# EAGLE design weather (EAGLE 9.5.1)
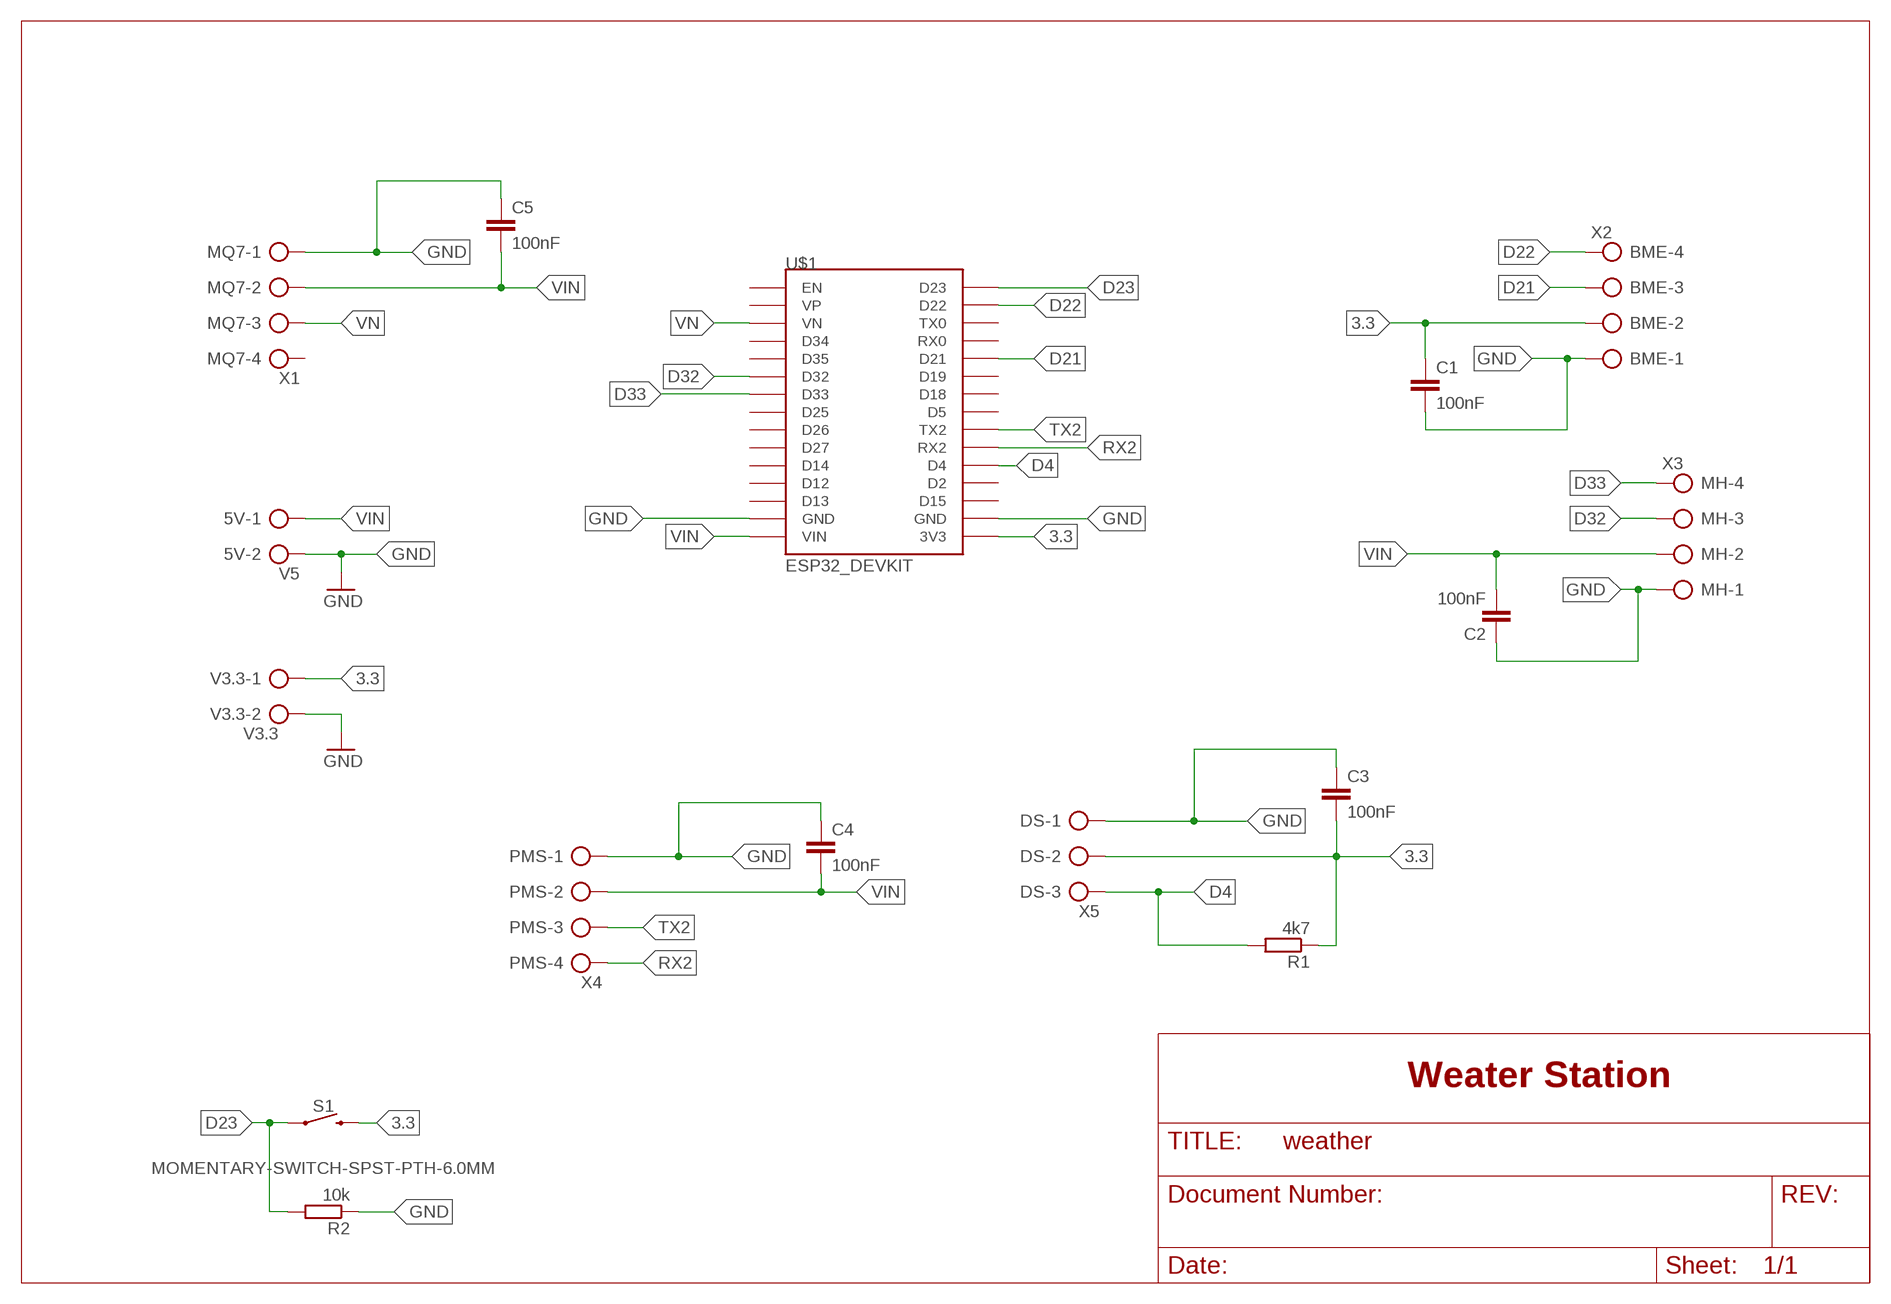
[diagram p0: schematic, sheet 1]

## Parts
5V  V5  AK500/2-H  [AK500/2-H]
BME  X2  AK500/4-H  [AK500/4-H]
C1  100nF  C-EU050-025X075  [C050-025X075]
C2  100nF  C-EU050-025X075  [C050-025X075]
C3  100nF  C-EU050-025X075  [C050-025X075]
C4  100nF  C-EU050-025X075  [C050-025X075]
C5  100nF  C-EU050-025X075  [C050-025X075]
DS  X5  AK500/3-H  [AK500/3-H]
MH  X3  AK500/4-H  [AK500/4-H]
MQ7  X1  AK500/4-H  [AK500/4-H]
PMS  X4  AK500/4-H  [AK500/4-H]
R1  4k7  R-EU_0207/10  [0207/10]
R2  10k  R-EU_0207/10  [0207/10]
S1  MOMENTARY-SWITCH-SPST-PTH-6.0MM  [TACTILE_SWITCH_PTH_6.0MM]
U$1  ESP32_DEVKIT  [ESP32_DEVKIT]
V3.3  V3.3  AK500/2-H  [AK500/2-H]

## Nets
3.3: BME.2 C1.1 C3.2 DS.2 R1.1 S1.3 U$1.3V3 V3.3.1
D4: DS.3 R1.2 U$1.D4
D21: BME.3 U$1.D21
D22: BME.4 U$1.D22
D23: R2.2 S1.1 U$1.D23
D32: MH.3 U$1.D32
D33: MH.4 U$1.D33
GND: 5V.2 BME.1 C1.2 C2.1 C3.1 C4.1 C5.1 DS.1 MH.1 MQ7.1 PMS.1 R2.1 U$1.GND@1(GND) U$1.GND@2(GND) V3.3.2
RX2: PMS.4 U$1.RX2
TX2: PMS.3 U$1.TX2
VIN: 5V.1 C2.2 C4.2 C5.2 MH.2 MQ7.2 PMS.2 U$1.VIN
VN: MQ7.3 U$1.VN
Unconnected: MQ7.4 U$1.D2 U$1.D5 U$1.D12 U$1.D13 U$1.D14 U$1.D15 U$1.D18 U$1.D19 U$1.D25 U$1.D26 U$1.D27 U$1.D34 U$1.D35 U$1.EN U$1.RX0 U$1.TX0 U$1.VP

## Notes on the sheet
- Weater Station

## Library data of the parts
5V V3.3 = con-ptr500:AK500/2-H: CONNECTOR Aug. 2004 / PTR Meßtechnik: Die Bezeichnung der Serie AK505 wurde geändert. Es handelt sich hierbei um AK500 in horizontaler Ausführung.; OC_FARNELL: unknown; OC_NEWARK: unknown
BME MH MQ7 PMS = con-ptr500:AK500/4-H: CONNECTOR Aug. 2004 / PTR Meßtechnik: Die Bezeichnung der Serie AK505 wurde geändert. Es handelt sich hierbei um AK500 in horizontaler Ausführung.; OC_FARNELL: unknown; OC_NEWARK: unknown
C1-C5 = rcl:C-EU: CAPACITOR, European symbol; SPICEPREFIX: C
DS = con-ptr500:AK500/3-H: CONNECTOR Aug. 2004 / PTR Meßtechnik: Die Bezeichnung der Serie AK505 wurde geändert. Es handelt sich hierbei um AK500 in horizontaler Ausführung.; OC_FARNELL: unknown; OC_NEWARK: unknown
R1 R2 = rcl:R-EU_: RESISTOR, European symbol; SPICEPREFIX: R
S1 = SparkFun-Switches:MOMENTARY-SWITCH-SPST: Momentary Switch (Pushbutton) - SPST Normally-open (NO) SPST momentary switches (buttons, pushbuttons). Variants PTH-12MM - 12mm square, through-hole Momentary Pushbutton Switch - 12mm Square <https://www.sparkfun.com/products/9190> (COM-09190) PTH-6.0MM, PTH-6.0MM-KIT - 6.0mm square, through-hole Mini Pushbutton Switch <https://www.sparkfun.com/products/97> (COM-00097) KIT package intended for soldering kit's - only one side of pads' copper is exposed. PTH-RIGHT-ANGLE-KIT - Right-angle, through-hole Right Angle Tactile Button <https://www.sparkfun.com/products/10791> - Used on SparkFun BigTime Watch Kit <https://www.sparkfun.com/products/11734> SMD-12MM - 12mm square, surface-mount Tactile Button - SMD (12mm) <https://www.sparkfun.com/products/12993> (COM-12993) Used on SparkFun PicoBoard <https://www.sparkfun.com/products/11888> SMD-4.5MM - 4.5mm Square Trackball Switch Used on SparkFun Blackberry Trackballer Breakout <https://www.sparkfun.com/products/13169> SMD-4.6MMX2.8MM - 4.60mm x 2.80mm, surface mount Used on SparkFun SAMD21 Mini Breakout <https://www.sparkfun.com/products/13664> SMD-5.2MM, SMD-5.2-REDUNDANT - 5.2mm square, surface-mount Mini Pushbutton Switch - SMD <https://www.sparkfun.com/products/8720> (COM-08720) Used on Arduino Pro Mini <https://www.sparkfun.com/products/11114> REDUNDANT package connects both switch circuits together SMD-6.0X3.5MM - 6.0 x 3.5mm, surface mount Momentary Reset Switch SMD <https://www.sparkfun.com/products/8229> (COM-08229) SMD-6.2MM-TALL - 6.2mm square, surface mount Tactile Button - SMD (6mm) <https://www.sparkfun.com/products/12992> Used on SparkFun Digital Sandbox <https://www.sparkfun.com/products/12651> SMD-RIGHT-ANGLE - Right-angle, surface mount Used on SparkFun Block for Intel® Edison - Arduino <https://www.sparkfun.com/products/13036>; PROD_ID: SWCH-08441; SF_SKU: COM-00097
U$1 = DOIT_ESP32_DEVKIT:ESP32_DEVKIT: ESP32 DEVKIT BOARD

## Board
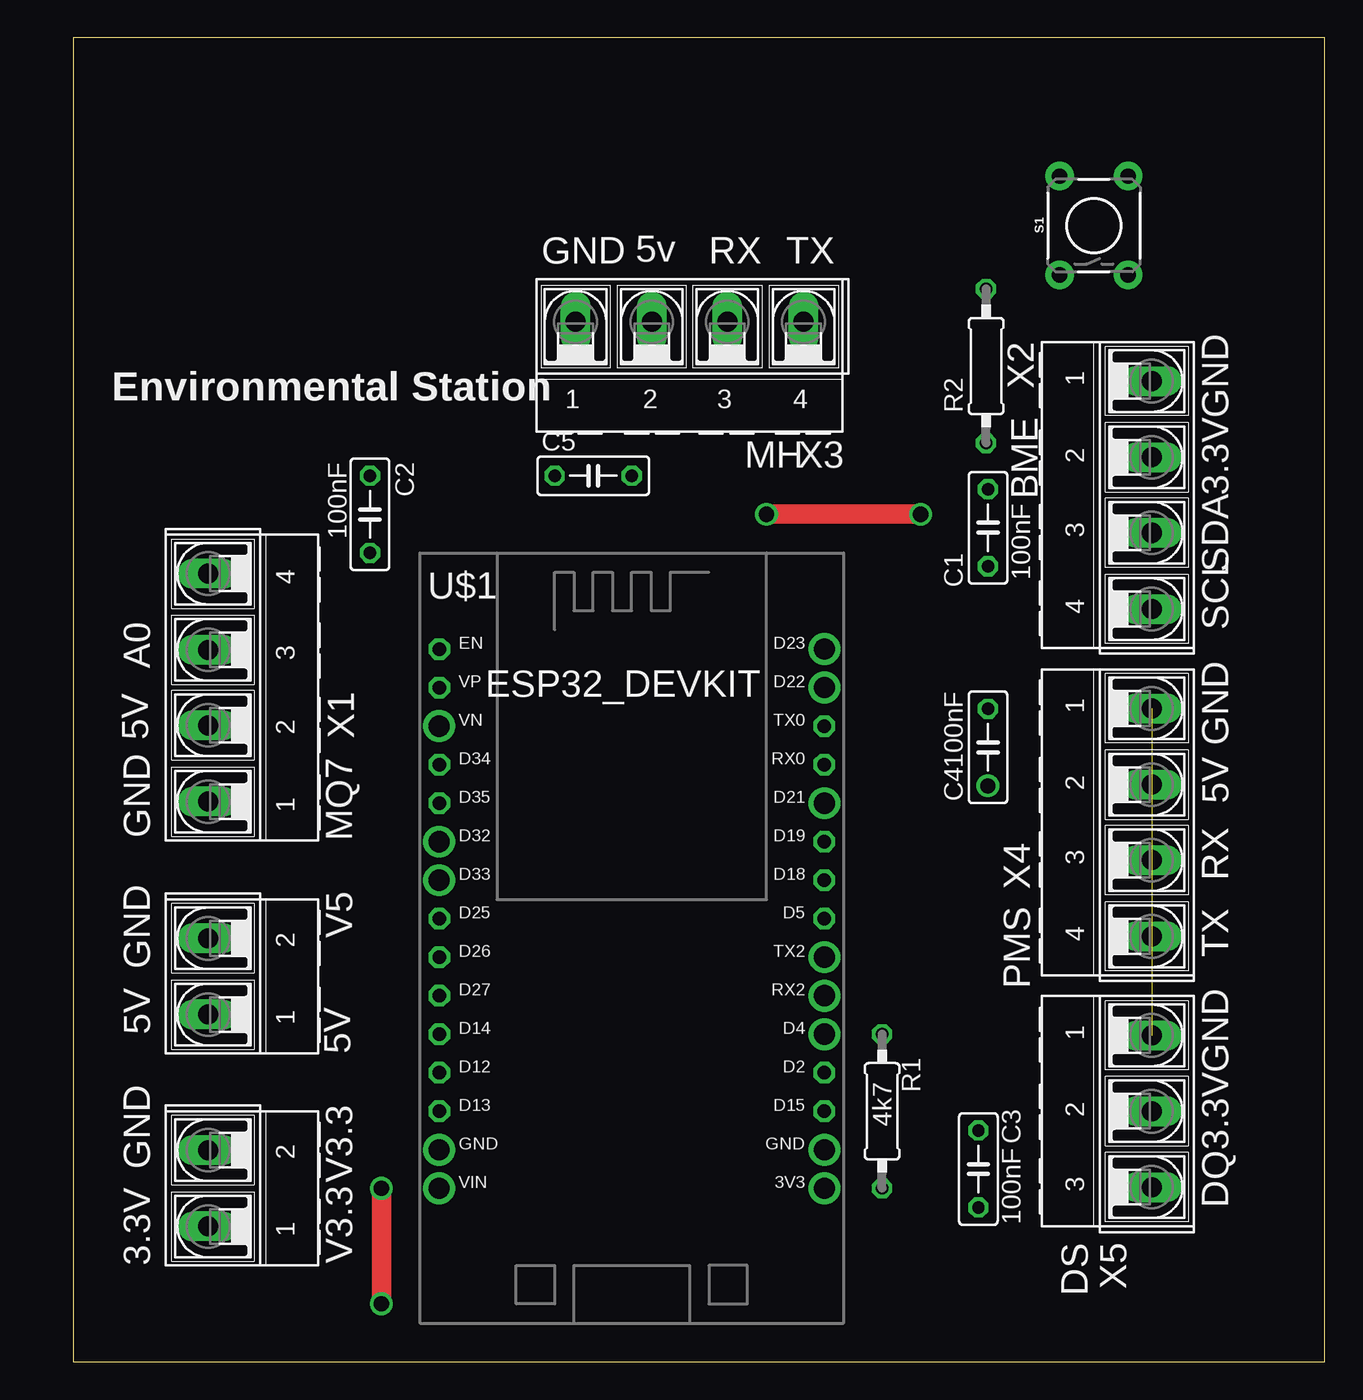
[diagram p1: board, top side]
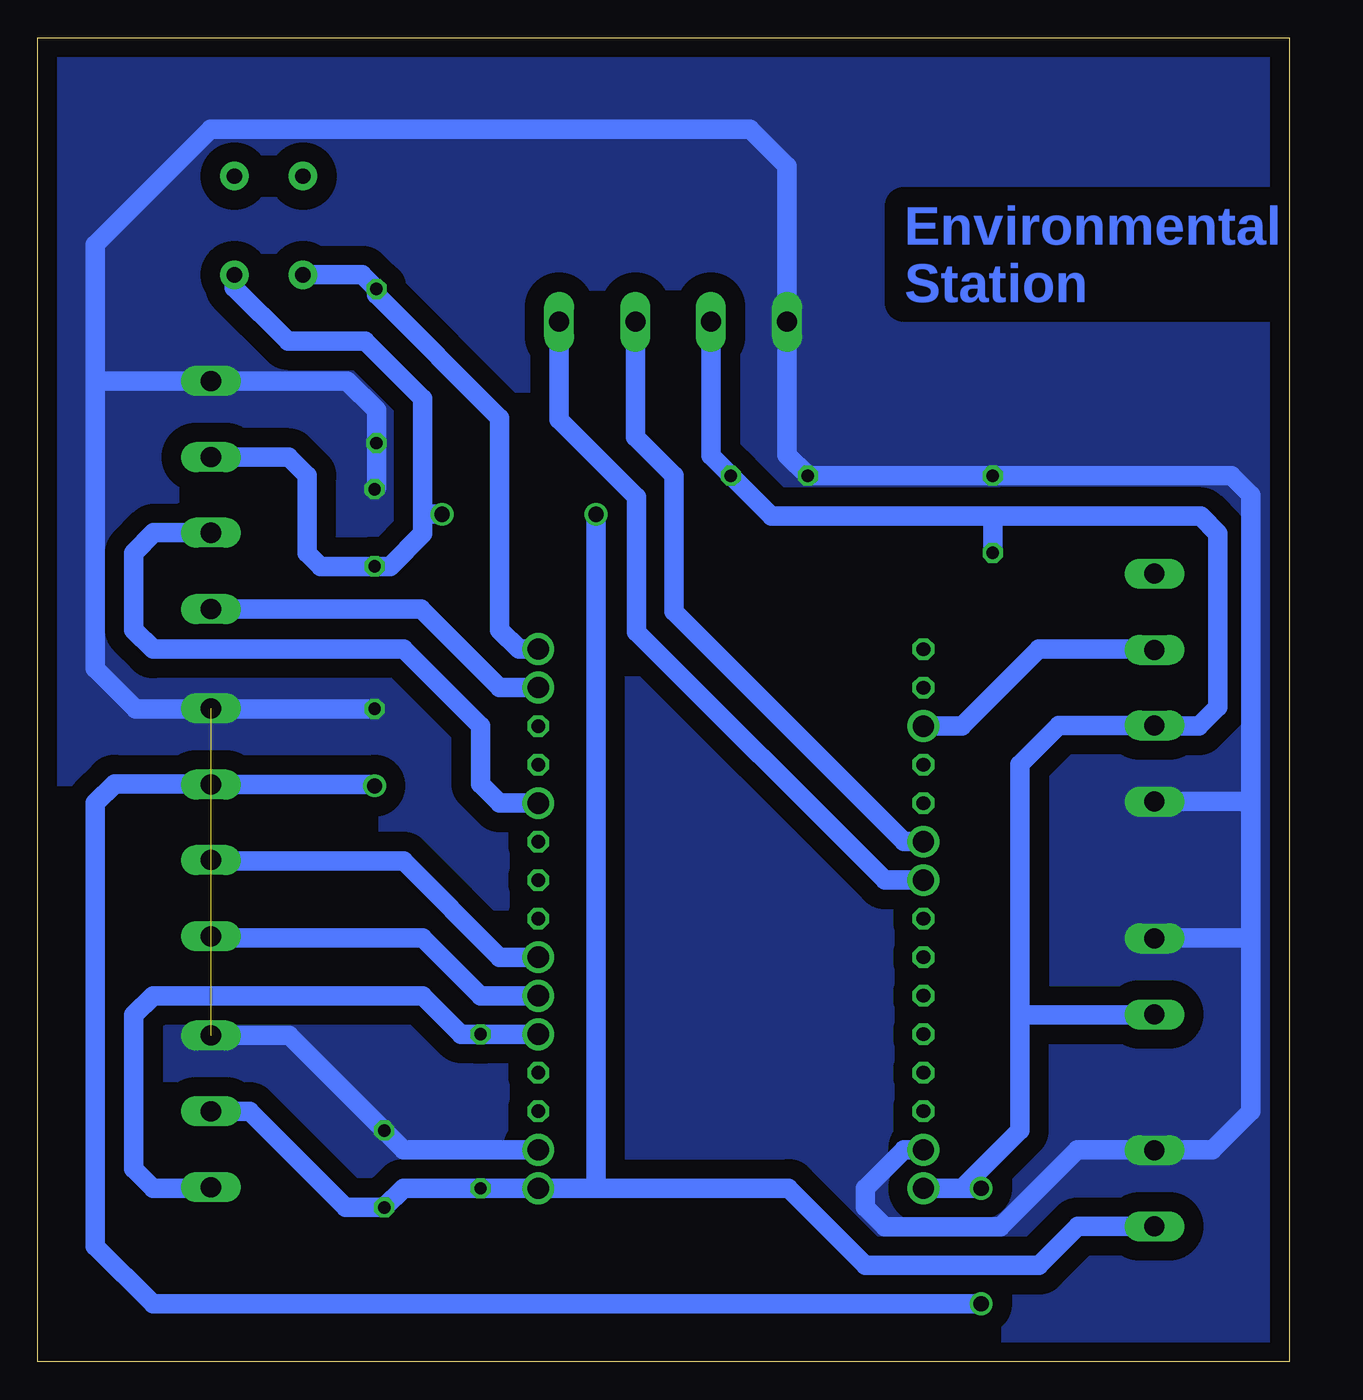
[diagram p2: board, bottom side, seen from below]

Size 82.53 x 87.3 mm. Coordinates in mm from the lower left corner, seen from the top.
Outline: 0,0 82.53,0 82.53,87.3 0,87.3 0,0
Copper layers (1*16): Top 0.035mm / dielectric 1.5mm / Bottom 0.035mm
Design rules "default": minimum track width 6mil, minimum drill 0.35mm, track to track 6mil, track to pad 6mil, pad to pad 6mil, via to via 6mil, smd to smd 6mil, copper to edge 40mil, drill to drill 6mil, minimum pad ring 10mil, minimum via ring 8mil, stop-mask expansion 4mil, vias tented up to drill 0mil, thermal gap 10mil

### Footprints (pad centres in the part's own frame; a part is rotated, then mirrored left to right if it is on the bottom)
AK500/2-H = drill 1.321 long: 1 -2.515,0; 2 2.515,0
AK500/4-H = drill 1.321 long: 1 -7.518,0; 2 -2.489,0; 3 2.489,0; 4 7.518,0
C050-025X075 = drill 0.813 octagon: 1 -2.54,0; 2 2.54,0
AK500/3-H = drill 1.321 long: 1 -5.004,0; 2 0,0; 3 5.004,0
0207/10 = drill 0.813 octagon: 1 -5.08,0; 2 5.08,0
TACTILE_SWITCH_PTH_6.0MM = drill 1.016 pad 1.88: 1 -3.251,2.261; 2 3.251,2.261; 3 -3.251,-2.261; 4 3.251,-2.261
ESP32_DEVKIT = drill 0.9 pad 1.422 octagon: 3V3 11.43,-17.78; D2 11.43,-10.16; D4 11.43,-7.62; D5 11.43,0; D12 -13.97,-10.16; D13 -13.97,-12.7; D14 -13.97,-7.62; D15 11.43,-12.7; D18 11.43,2.54; D19 11.43,5.08; D21 11.43,7.62; D22 11.43,15.24; D23 11.43,17.78; D25 -13.97,0; D26 -13.97,-2.54; D27 -13.97,-5.08; D32 -13.97,5.08; D33 -13.97,2.54; D34 -13.97,10.16; D35 -13.97,7.62; EN -13.97,17.78; GND@1 -13.97,-15.24; GND@2 11.43,-15.24; RX0 11.43,10.16; RX2 11.43,-5.08; TX0 11.43,12.7; TX2 11.43,-2.54; VIN -13.97,-17.78; VN -13.97,12.7; VP -13.97,15.24

### Placement (x,y rotation side)
5V  8.89,25.4 90 top
BME  71.12,57.15 270 top
C1  60.33,54.99 90 top
C2  19.56,55.88 270 top
C3  59.69,12.7 270 top
C4  60.33,40.51 270 top
C5  34.29,58.42 0 top
DS  71.12,16.51 270 top
MH  40.64,68.58 0 top
MQ7  8.89,44.45 90 top
PMS  71.12,35.56 270 top
R1  53.34,16.51 90 top
R2  60.2,65.66 90 top
S1  67.31,74.93 90 top
U$1  38.1,29.21 0 top
V3.3  8.89,11.43 90 top

### Tracks (layer width: path | path; a pad name or v marks a point on that pad's centre or on a via)
3.3  (via drill 1)
  Top 1.27: v45.72,55.88 v55.88,55.88
  Bottom 1.27: 45.72,11.43 U$1.3V3 R1.1 58.42,11.43 C3.2 62.23,10.16 68.58,16.51 DS.2 | 45.72,11.43 33.02,11.43 27.94,6.35 16.51,6.35 13.95,8.91 V3.3.1 | BME.2 65.99,59.64 64.77,58.42 64.77,53.34 63.88,52.45 C1.1 59.31,52.45 57.15,54.61 57.15,55.88 | S1.3 69.57,70.84 66.04,67.31 60.96,67.31 57.15,63.5 57.15,55.88 | 45.72,11.43 v45.72,55.88 | v55.88,55.88 57.15,55.88
D4
  Bottom 0.152: 71.12,11.43 DS.3
  Bottom 1.27: U$1.D4 R1.2 54.61,21.59 57.15,24.13 74.93,24.13 76.2,22.86 76.2,12.7 74.93,11.43 71.12,11.43
D21
  Bottom 1.27: U$1.D21 52.07,36.83 53.34,38.1 53.34,41.91 58.42,46.99 74.93,46.99 76.2,48.26 76.2,53.34 74.88,54.66 BME.3
D22
  Bottom 1.27: U$1.D22 52.07,44.45 57.25,49.63 BME.4
D23
  Bottom 0.152: 60.2,70.36 R2.2
  Bottom 1.27: U$1.D23 50.8,46.99 52.07,48.26 52.07,62.23 60.2,70.36 | S1.1 61.14,71.68 R2.2
D32
  Bottom 1.27: MH.3 43.13,60.96 40.59,58.42 40.59,49.48 25.4,34.29 U$1.D32
D33
  Bottom 1.27: MH.4 48.16,62.13 43.05,57.02 43.05,48.13 26.67,31.75 U$1.D33
GND  (1 unrouted)
  Bottom 0.152: 8.87,13.97 V3.3.2 8.91,13.97 | 5V.2 8.87,27.94 | 2.64,36.93 2.54,36.83 | 71.09,43.05 PMS.1 | 60.2,57.66 C1.2
  Bottom 1.27: 2.54,27.94 2.54,36.83 2.54,57.15 3.81,58.42 C2.1 C5.1 33.12,59.79 MH.1 33.12,78.84 35.56,81.28 71.12,81.28 78.74,73.66 78.74,64.77 | 2.54,27.94 2.54,16.51 5.08,13.97 8.87,13.97 | 8.87,27.94 2.54,27.94 | MQ7.1 2.64,36.93 | 8.91,13.97 13.97,13.97 19.05,8.89 26.67,8.89 27.94,10.16 27.94,11.43 25.4,13.97 U$1.GND@1 | U$1.GND@2 58.42,13.97 C3.1 65.96,21.51 DS.1 | C4.1 71.09,43.05 76.07,43.05 78.74,45.72 78.74,64.77 | 60.2,57.66 R2.1 60.2,62.74 62.13,64.67 BME.1 78.64,64.67 78.74,64.77
  pour Bottom (isolate 1.27, no thermals): 1.27,86.36 81.28,86.36 81.28,1.27 1.27,1.27
N$1  (via drill 1.4)
  other vias: 24.13,41.91
N$2  (via drill 1.4)
  other vias: 49.53,46.99
N$3  (via drill 1.4)
  other vias: 24.13,31.75
N$4  (via drill 1.4)
  other vias: 24.13,13.97
N$5  (via drill 1.4)
  other vias: 24.13,34.29
N$6  (via drill 1.4)
  other vias: 49.53,44.45
N$7  (via drill 1.4)
  other vias: 49.53,26.67
N$8  (via drill 1.4)
  other vias: 49.53,36.83
N$9  (via drill 1.4)
  other vias: 49.53,24.13
N$10  (via drill 1.4)
  other vias: 24.13,11.43
N$11  (via drill 1.4)
  other vias: 49.53,11.43
N$12  (via drill 1.4)
  other vias: 49.53,21.59
N$13  (via drill 1.4)
  other vias: 49.53,13.97
N$14  (via drill 1)
  other vias: 60.33,37.97
RX2
  Bottom 0.152: 71.12,27.94 PMS.4
  Bottom 1.27: U$1.RX2 53.34,24.13 57.15,27.94 71.12,27.94
TX2
  Bottom 0.152: 71.12,33.02 PMS.3
  Bottom 1.27: U$1.TX2 52.07,26.67 58.42,33.02 71.12,33.02
VIN  (via drill 1)
  Top 1.27: v20.32,11.43 v20.32,3.81
  Bottom 0.152: C2.2 19.05,53.34 | 8.84,41.91 MQ7.2 | 8.91,22.86 5V.1 | 19.56,55.24 19.05,55.75 | C4.2 60.4,38.05 | 71.12,38.1 PMS.2
  Bottom 1.27: MH.2 38.15,59.74 C5.2 34.16,55.75 19.05,55.75 5.84,55.75 4.7,54.61 4.7,43.18 5.97,41.91 8.84,41.91 | MQ7.2 15.19,41.96 17.78,39.37 17.78,22.86 | 17.78,22.86 8.91,22.86 | C2.2 19.56,55.24 | U$1.VIN 21.59,11.43 | 21.59,11.43 17.78,15.24 17.78,22.86 | 60.4,38.05 PMS.2 | 21.59,11.43 v20.32,11.43 | v20.32,3.81 74.93,3.81 78.74,7.62 78.74,36.83 77.47,38.1 71.12,38.1
VN
  Bottom 0.152: 8.94,46.99 MQ7.3
  Bottom 1.27: U$1.VN 21.59,41.91 16.51,46.99 15.24,46.99 8.94,46.99

### Text on the board
Bottom: Environmental / Station
tNames: 5v | GND | RX | TX | Environmental Station | GND | 3.3V | SDA | SCL | A0 | 5V | GND | 5V | GND | RX | TX | GND | 5V | GND | 3.3V | GND | DQ | 3.3V